# Altium schematic sheet LTC4316 I2C Address Translator.SchDoc: LTC4316 I2C Address Translator
size Letter; SheetNumber: 8; SheetTotal: 18
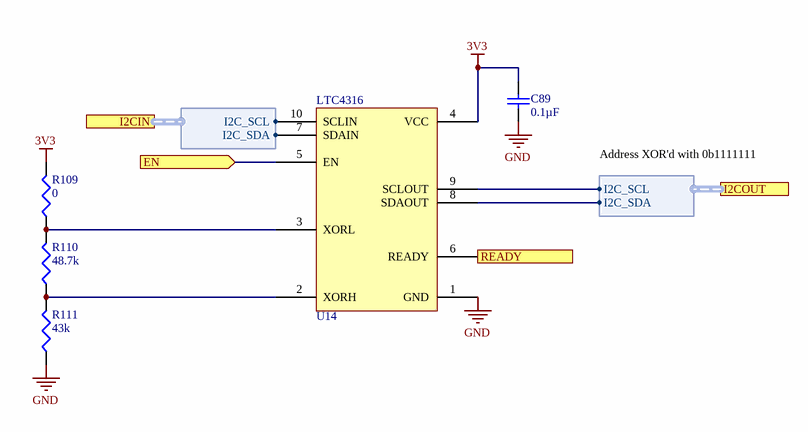
[diagram p0: LTC4316 I2C Address Translator.SchDoc]

## Parts
C89  value 0.1µF  [TDK-CGA2B]  (hidden comment: Cap)
R109  value 0  [PANA-ERJ2G]  (hidden comment: Jumper)
R110  value 48.7k  [PANA-ERJ2R]  (hidden comment: Res3)
R111  value 43k  [PANA-ERJ2R]  (hidden comment: Res3)
U14  LTC4316  [LT-05-08-1661]

## Ports
EN (in), I2CIN (harness LTC4316_I2CIN), I2COUT (harness LTC4316_I2COUT), READY (out)

## Harnesses
LTC4316_I2CIN: I2C_SCL, I2C_SDA
LTC4316_I2COUT: I2C_SCL, I2C_SDA

## Nets
3V3: C89.1 R109.2 U14.4(VCC)
GND: C89.2 R111.1 U14.1(GND)
EN: U14.5(EN) ; port EN
READY: U14.6(READY) ; port READY
NetR109_1: R109.1 R110.2 U14.3(XORL)
NetR110_1: R110.1 R111.2 U14.2(XORH)
NetU14_7: U14.7(SDAIN) ; port I2CIN.I2C_SDA
NetU14_8: U14.8(SDAOUT) ; port I2COUT.I2C_SDA
NetU14_9: U14.9(SCLOUT) ; port I2COUT.I2C_SCL
NetU14_10: U14.10(SCLIN) ; port I2CIN.I2C_SCL

## Notes on the sheet
- Address XOR'd with 0b1111111
- (the "License"); you may not use or redistribute this file except in compliance with the License. You
- This file and the information within it are licensed under the terms of the Apache License, Version 2.0
- Copyright
- Unless required by applicable law or agreed to in writing, content distributed under the License is
- distributed on an "AS IS" BASIS, WITHOUT WARRANTIES OR CONDITIONS OF ANY KIND,
- either express or implied. See the License for the specific language governing permissions and
- limitations under the License.
- may obtain a copy of the License at:
- http://www.apache.org/licenses/LICENSE-2.0
- Title
- Size:
- Date:
- Letter
- Number:
- Time:
- Revision:
- Sheet
- of
- University of Alberta
- Deptartment of Electrical
- and Computer Engineering
- Edmonton AB, Canada
- T6G 1H9
- File:

## Library data of the parts
C89 = PC-TDK-02259: CAP CER 0.1UF 50V X7R 0402; Manufacturer Part Number: CGA2B3X7R1H104K050BB; Index: 2259; Designator: C?; Tolerance: ±10%; Published: 2016-03-16; LatestRevisionDate: 2016-03-16; LatestRevisionNote: ...; PackageReference: 0402 (1005 Metric); Publisher: AlbertaSat; PackageDescription: Radial Cap, Thru-Hole; 2 Leads; 0.3 in Pin Spacing; Part Number: PC-TDK-02259; Supplier Part Number 1: 445-6899-1-ND; Supplier 1: Digi-key; Supplier Link: http://www.digikey.ca/product-search/en?keywords=445-6899-1-ND; Voltage - Rated: 50V; Temperature Coefficient: X7R; Applications: Automotive
R109 = 13127: RES SMD 0.0OHM JUMPER 1/10W 0402; Part Number: 13127; Manufacturer Part Number: ERJ-2GE0R00X; Designator: R?; Power: 0.1W, 1/10W; PackageDescription: Chip Resistor, 2-Leads, Body 1.00x0.50mm, IPC Low Density; Supplier Part Number 1: P0.0JCT-ND; Supplier 1: Digi-Key; Supplier Link: http://www.digikey.ca/product-search/en?keywords=P0.0JCT-ND; PackageReference: 0402 (1005 Metric); Tolerance: Jumper; Temperature Coefficient: -; Type: Jumper
R110 = 18312: RES SMD 48.7K OHM 1% 1/10W 0402; Part Number: 18312; Manufacturer Part Number: ERJ-2RKF4872X; Designator: R?; Power: 0.1W, 1/10W; Temperature Coefficient: ±100ppm/°C; Published: 8-Jun-2000; LatestRevisionDate: 29-May-2009; LatestRevisionNote: IPC-7351 Footprint Added.; PackageReference: 0402 (1005 Metric); Publisher: Altium Limited; PackageDescription: Chip Resistor, 2-Leads, Body 1.00x0.50mm, IPC Low Density; Supplier Part Number 1: P48.7KLCT-ND; Supplier 1: Digi-Key; Supplier Link: http://www.digikey.ca/product-search/en?keywords=P48.7KLCT-ND; Tolerance: ±1%
R111 = 18224: RES SMD 43K OHM 1% 1/10W 0402; Part Number: 18224; Manufacturer Part Number: ERJ-2RKF4302X; Designator: R?; Power: 0.1W, 1/10W; Temperature Coefficient: ±100ppm/°C; Published: 8-Jun-2000; LatestRevisionDate: 29-May-2009; LatestRevisionNote: IPC-7351 Footprint Added.; PackageReference: 0402 (1005 Metric); Publisher: Altium Limited; PackageDescription: Chip Resistor, 2-Leads, Body 1.00x0.50mm, IPC Low Density; Supplier Part Number 1: P43.0KLCT-ND; Supplier 1: Digi-Key; Supplier Link: http://www.digikey.ca/product-search/en?keywords=P43.0KLCT-ND; Tolerance: ±1%
U14 = PU-LTC-00049: IC ACCELERATR I2C HOTSWAP 10MSOP; Manufacturer Part Number: LTC4316IMS#PBF; Index: 49; Part Number: PU-LTC-00049; Supplier Part Number 1: LTC4316IMS#PBF-ND; Supplier 1: Digi-key; Supplier Part Number 2: 584-LTC4316IMS#PBF; Supplier 2: Mouser; Publisher: AlbertaSat; Published: 2019-07-03; LatestRevisionDate: 2019-07-03; LatestRevisionNote: ...; PackageReference: 10-MSOP; Supplier Link: https://www.digikey.ca/product-detail/en/linear-technology-analog-devices/LTC4316IMS-PBF/LTC4316IMS-PBF-ND/5297622